# Altium schematic sheet Connector to Connector.SchDoc
size A3; SheetNumber: 1; SheetTotal: 1
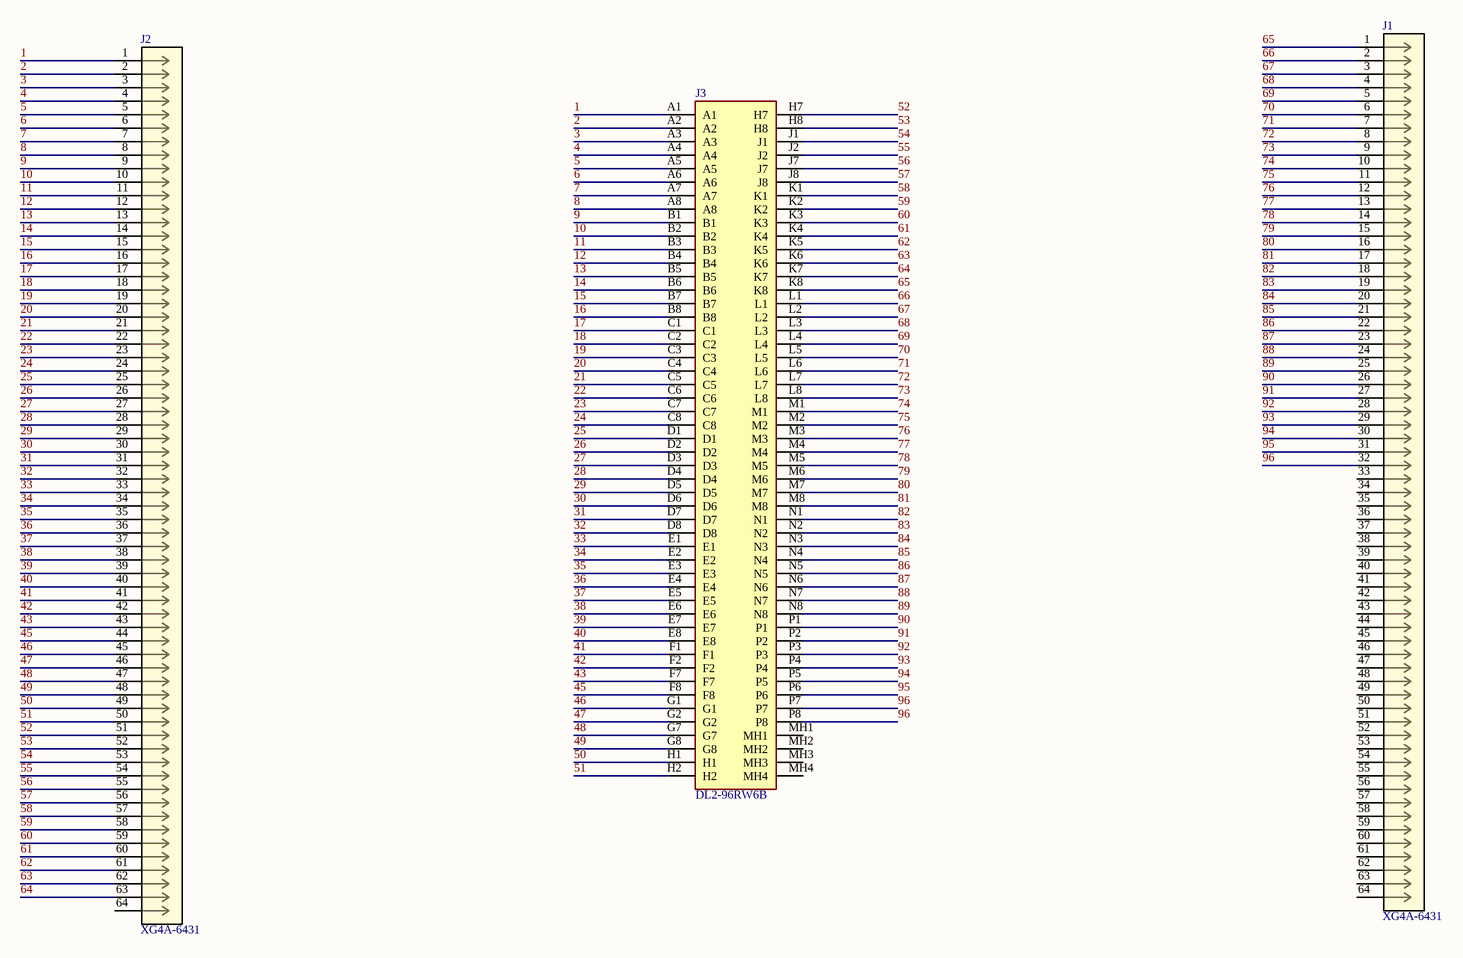
[diagram p0: Connector to Connector.SchDoc]

## Parts
J1  XG4A-6431  [CONN_XG4A-6431_OMR]
J2  XG4A-6431  [CONN_XG4A-6431_OMR]
J3  DL2-96RW6B  [DL296RW6B]

## Nets
1: J2.1 J3.A1
2: J2.2 J3.A2
3: J2.3 J3.A3
4: J2.4 J3.A4
5: J2.5 J3.A5
6: J2.6 J3.A6
7: J2.7 J3.A7
8: J2.8 J3.A8
9: J2.9 J3.B1
10: J2.10 J3.B2
11: J2.11 J3.B3
12: J2.12 J3.B4
13: J2.13 J3.B5
14: J2.14 J3.B6
15: J2.15 J3.B7
16: J2.16 J3.B8
17: J2.17 J3.C1
18: J2.18 J3.C2
19: J2.19 J3.C3
20: J2.20 J3.C4
21: J2.21 J3.C5
22: J2.22 J3.C6
23: J2.23 J3.C7
24: J2.24 J3.C8
25: J2.25 J3.D1
26: J2.26 J3.D2
27: J2.27 J3.D3
28: J2.28 J3.D4
29: J2.29 J3.D5
30: J2.30 J3.D6
31: J2.31 J3.D7
32: J2.32 J3.D8
33: J2.33 J3.E1
34: J2.34 J3.E2
35: J2.35 J3.E3
36: J2.36 J3.E4
37: J2.37 J3.E5
38: J2.38 J3.E6
39: J2.39 J3.E7
40: J2.40 J3.E8
41: J2.41 J3.F1
42: J2.42 J3.F2
43: J2.43 J3.F7
45: J2.44 J3.F8
46: J2.45 J3.G1
47: J2.46 J3.G2
48: J2.47 J3.G7
49: J2.48 J3.G8
50: J2.49 J3.H1
51: J2.50 J3.H2
52: J2.51 J3.H7
53: J2.52 J3.H8
54: J2.53 J3.J1
55: J2.54 J3.J2
56: J2.55 J3.J7
57: J2.56 J3.J8
58: J2.57 J3.K1
59: J2.58 J3.K2
60: J2.59 J3.K3
61: J2.60 J3.K4
62: J2.61 J3.K5
63: J2.62 J3.K6
64: J2.63 J3.K7
65: J1.1 J3.K8
66: J1.2 J3.L1
67: J1.3 J3.L2
68: J1.4 J3.L3
69: J1.5 J3.L4
70: J1.6 J3.L5
71: J1.7 J3.L6
72: J1.8 J3.L7
73: J1.9 J3.L8
74: J1.10 J3.M1
75: J1.11 J3.M2
76: J1.12 J3.M3
77: J1.13 J3.M4
78: J1.14 J3.M5
79: J1.15 J3.M6
80: J1.16 J3.M7
81: J1.17 J3.M8
82: J1.18 J3.N1
83: J1.19 J3.N2
84: J1.20 J3.N3
85: J1.21 J3.N4
86: J1.22 J3.N5
87: J1.23 J3.N6
88: J1.24 J3.N7
89: J1.25 J3.N8
90: J1.26 J3.P1
91: J1.27 J3.P2
92: J1.28 J3.P3
93: J1.29 J3.P4
94: J1.30 J3.P5
95: J1.31 J3.P6
96: J1.32 J3.P7 J3.P8

Not connected (* = marked no-connect by the designer): J1 33 34 35 36 37 38 39 40 41 42 43 44 45 46 47 48 49 50 51 52 53 54 55 56 57 58 59 60 61 62 63 64; J2 64; J3 MH1 MH2 MH3 MH4

## Library data of the parts
J1 J2 = XG4A-6431: No Description Available; Mfr_Name: Omron; Copyright: Copyright (C) 2023 Ultra Librarian. All rights reserved.; Manufacturer_Part_Number: XG4A-6431; RefDes: RefDes; Type: DEV
J3 = DL2-96RW6B: Conn Rectangular SKT 96 POS 2.54mm Solder ST Thru-Hole Automotive; Manufacturer_Name: ITT CANNON; Geometry.Height: 25.2mm; Manufacturer_Part_Number: DL2-96RW6B; Mouser Part Number: *; Mouser Price/Stock: *; Arrow Part Number: DL2-96RW6B; Arrow Price/Stock: https://www.arrow.com/en/products/dl2-96rw6b/itt-corporation?region=nac; Datasheet Link: http://www.farnell.com/datasheets/1992568.pdf